# EasyEDA schematic SCH_LED-Chaser_2025-12-03.json
TITLE: LED Chaser; REV: 1.0; Date: 2025-12-03; Sheet: 1/1; Drawn By: a-finance-bro; Company: Your Company
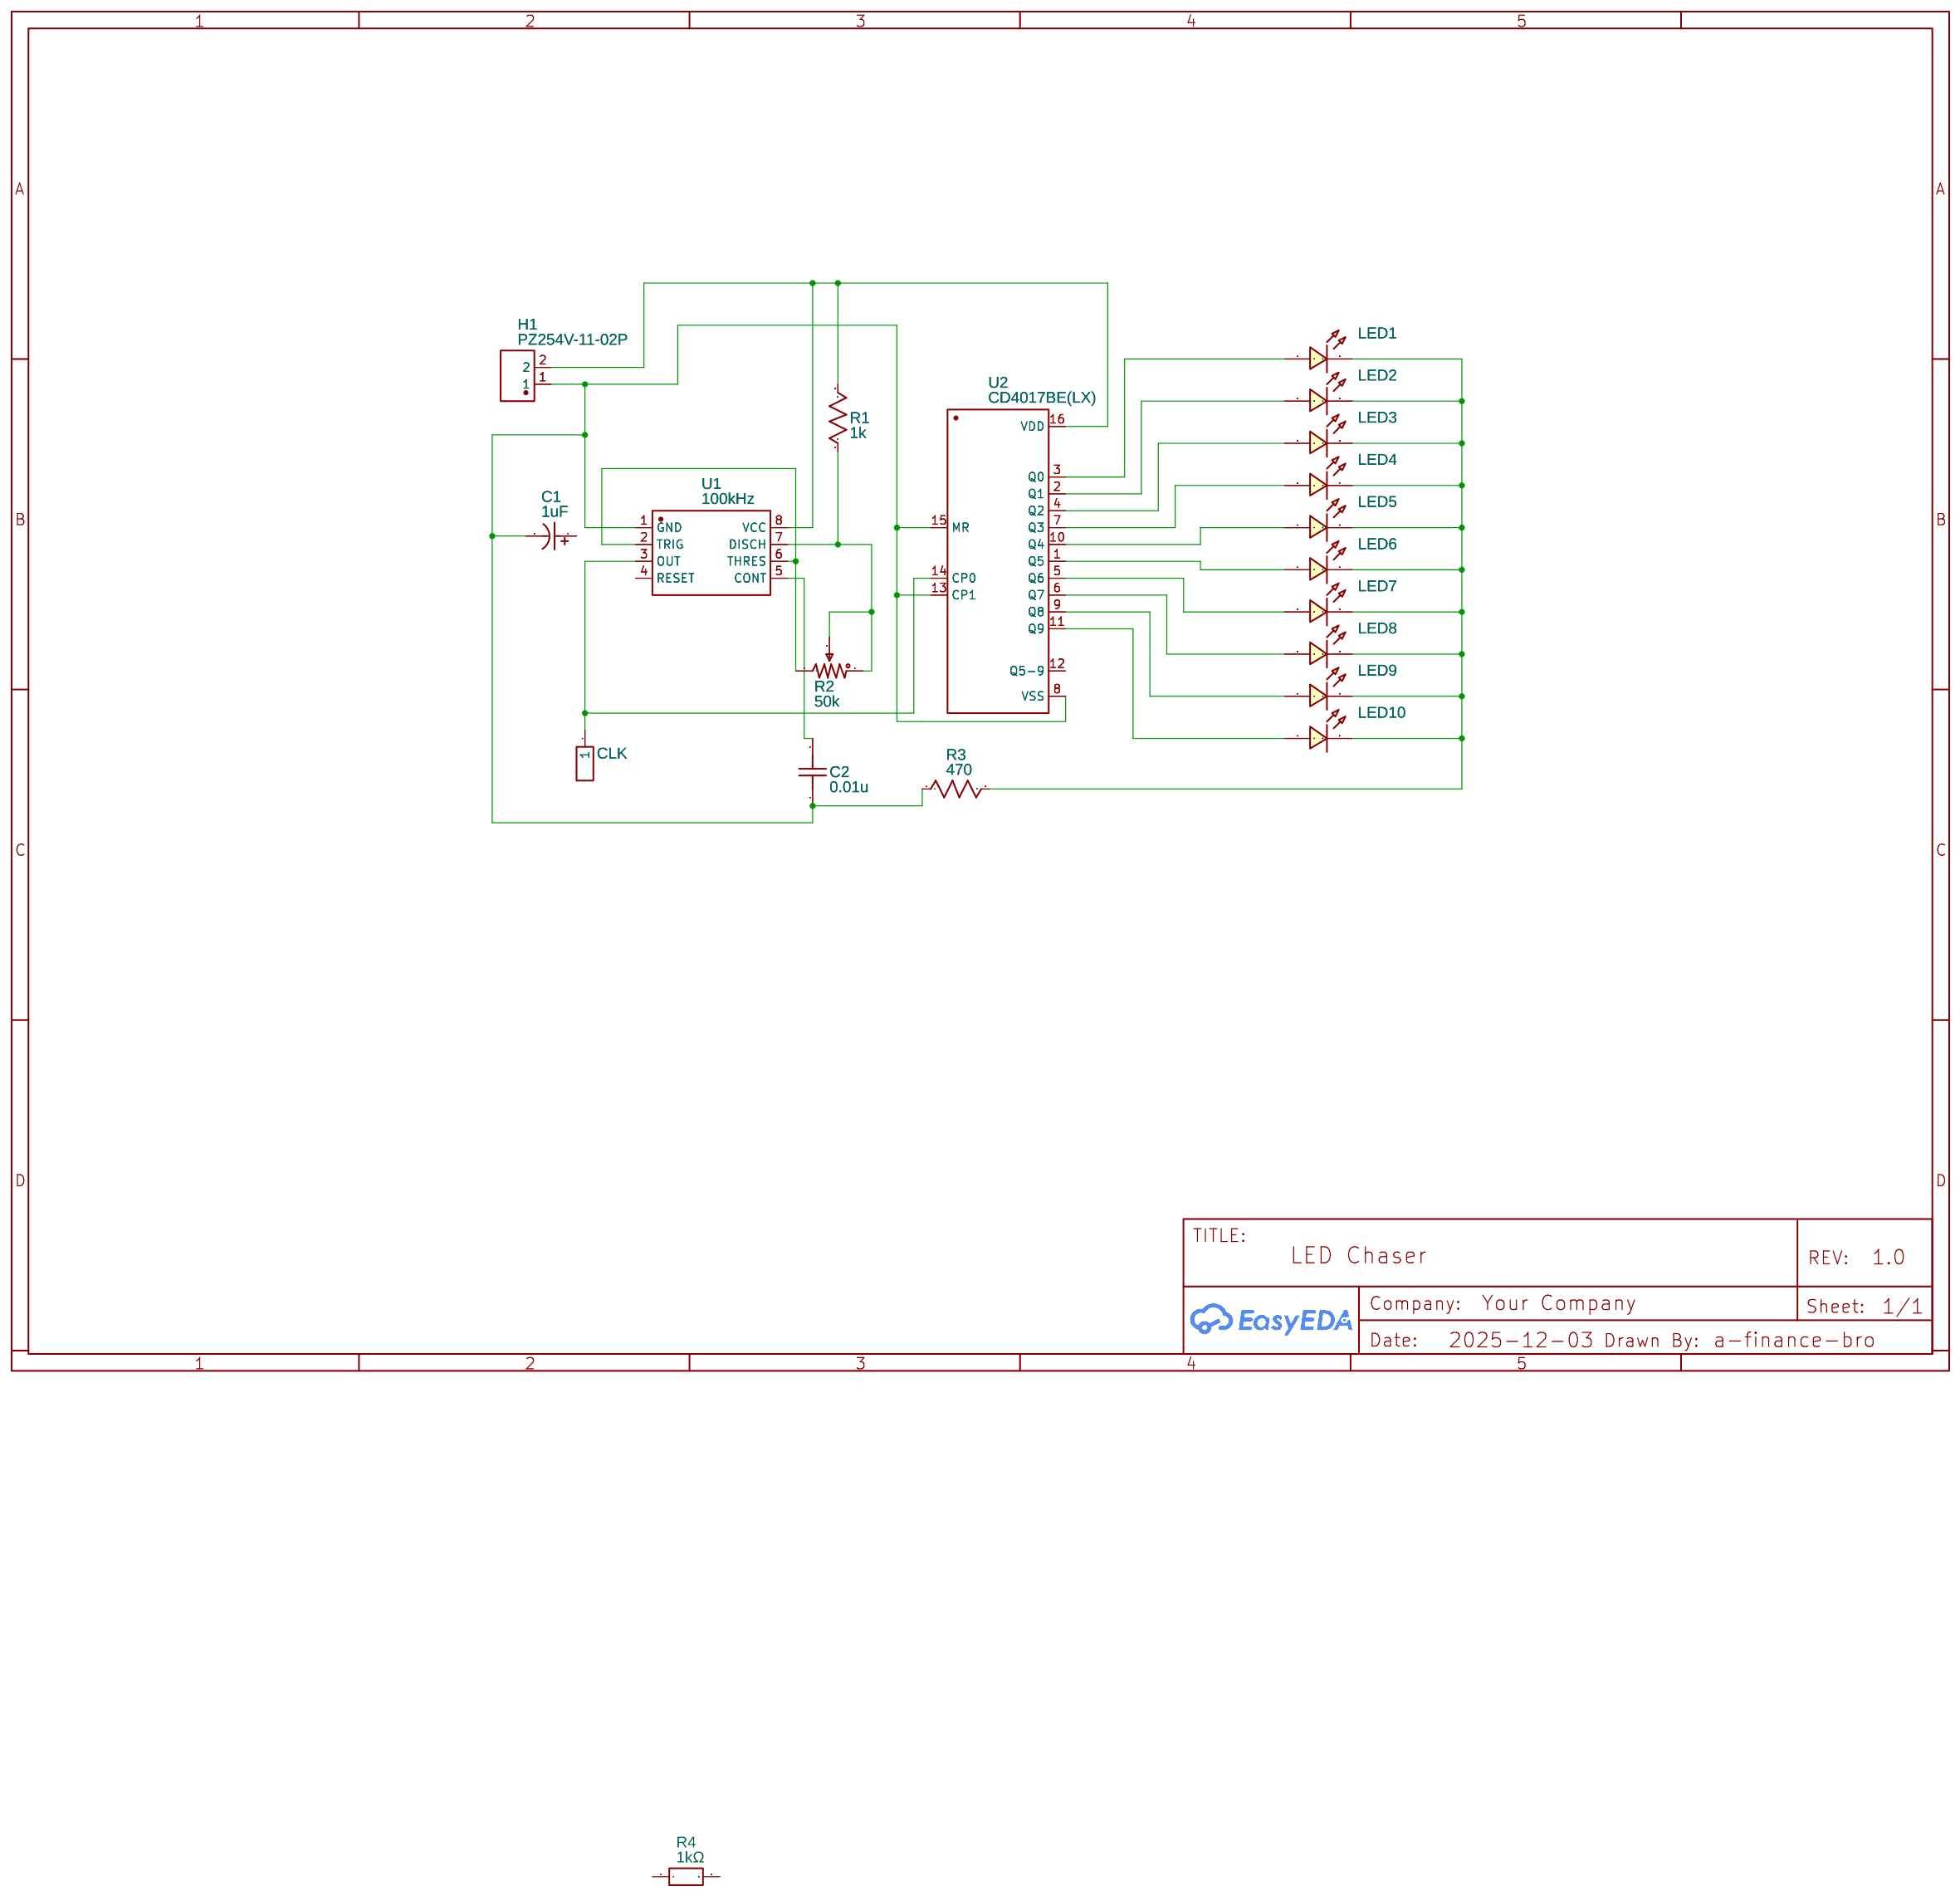
[diagram p0: schematic sheet]

## Parts
C1  1uF  [CAP-TH_BD5.0-P2.00-D0.8-FD]
C2  0.01u  [C0603]
CLK  HDR-M-2.54_1x1  [HDR-M-2.54_1X1]
H1  PZ254V-11-02P  [HDR-TH_2P-P2.54-V-M]
LED1  LED-0603_R  [LED0603_RED]
LED2  LED-0603_R  [LED0603_RED]
LED3  LED-0603_R  [LED0603_RED]
LED4  LED-0603_R  [LED0603_RED]
LED5  LED-0603_R  [LED0603_RED]
LED6  LED-0603_R  [LED0603_RED]
LED7  LED-0603_R  [LED0603_RED]
LED8  LED-0603_R  [LED0603_RED]
LED9  LED-0603_R  [LED0603_RED]
LED10  LED-0603_R  [LED0603_RED]
R1  1k  [R0603]
R2  50k  [RES-ADJ-TH_3386P]
R3  470  [R0603]
R4  1kΩ  [RES-TH_BD2.3-L6.5-P10.50-D0.5]
U1  100kHz  [DIP-8_L9.8-W6.6-P2.54-LS7.6-BL]
U2  CD4017BE(LX)  [PDIP-16_L19.3-W6.4-P2.54-LS7.94-BL]

## Library data of the parts
C1 = KF010M050C110A: Supplier: LCSC; Manufacturer: CapXon(丰宾); Supplier Part: C62934; JLCPCB Part Class: Extended Part
C2 = C_0603_US: Contributor: LCEDA_Lib
CLK = HDR-M-2.54_1x1: Supplier Part: C81276; Supplier: LCSC; Contributor: LCEDA_Lib
H1 = PZ254V-11-02P: Contributor: LCSC; Supplier: LCSC; Supplier Part: C492401; Manufacturer: XFCN(兴飞); JLCPCB Part Class: Extended Part
LED1-LED10 = LED-0603_R: Manufacturer: EVERLIGHT(台湾亿光); Manufacturer Part: 19-217/R6C-AL1M2VY/3T; Supplier Part: C72044; Supplier: LCSC; Contributor: LCEDA_01
R1 R3 = R_0603_US: Contributor: LCEDA_Lib
R2 = R_3386P_US: Supplier: LCSC; Contributor: LCEDA_Lib; value(Ω): 10K
R4 = MF1/4W-1KΩ±1%T52: Contributor: LCSC; Supplier: LCSC; Supplier Part: C713997; Manufacturer: 华星机电; JLCPCB Part Class: Extended Part
U1 = NE555P: Supplier: LCSC; Manufacturer: TI(德州仪器); Supplier Part: C46749; JLCPCB Part Class: Extended Part
U2 = CD4017BE(LX): Supplier: LCSC; Supplier Part: C32710674; Manufacturer: LX(灵星芯微); Contributor: lcsc; JLCPCB Part Class: Extended Part

## Nets
Net-(C1-2): C1.2 C2.1 H1.1 R3.1 U1.1(GND) U2.8(VSS) U2.13(CP1) U2.15(MR)
Net-(C2-2): C2.2 U1.5(CONT)
Net-(CLK-1): CLK.1 U1.3(OUT) U2.14(CP0)
Net-(H1-2): H1.2 R1.2 U1.8(VCC) U2.16(VDD)
Net-(LED1-1): LED1.1 U2.3(Q0)
Net-(LED1-2): LED1.2 LED2.2 LED3.2 LED4.2 LED5.2 LED6.2 LED7.2 LED8.2 LED9.2 LED10.2 R3.2
Net-(LED2-1): LED2.1 U2.2(Q1)
Net-(LED3-1): LED3.1 U2.4(Q2)
Net-(LED4-1): LED4.1 U2.7(Q3)
Net-(LED5-1): LED5.1 U2.10(Q4)
Net-(LED6-1): LED6.1 U2.1(Q5)
Net-(LED7-1): LED7.1 U2.5(Q6)
Net-(LED8-1): LED8.1 U2.6(Q7)
Net-(LED9-1): LED9.1 U2.9(Q8)
Net-(LED10-1): LED10.1 U2.11(Q9)
Net-(R1-1): R1.1 R2.1 R2.2 U1.7(DISCH)
Net-(R2-3): R2.3 U1.2(TRIG) U1.6(THRES)

Not connected (* = marked no-connect by the designer): C1 1; R4 1 2; U1 4(RESET); U2 12(Q5-9)
